# EAGLE design Engine Room Power Half (EAGLE 6.2)
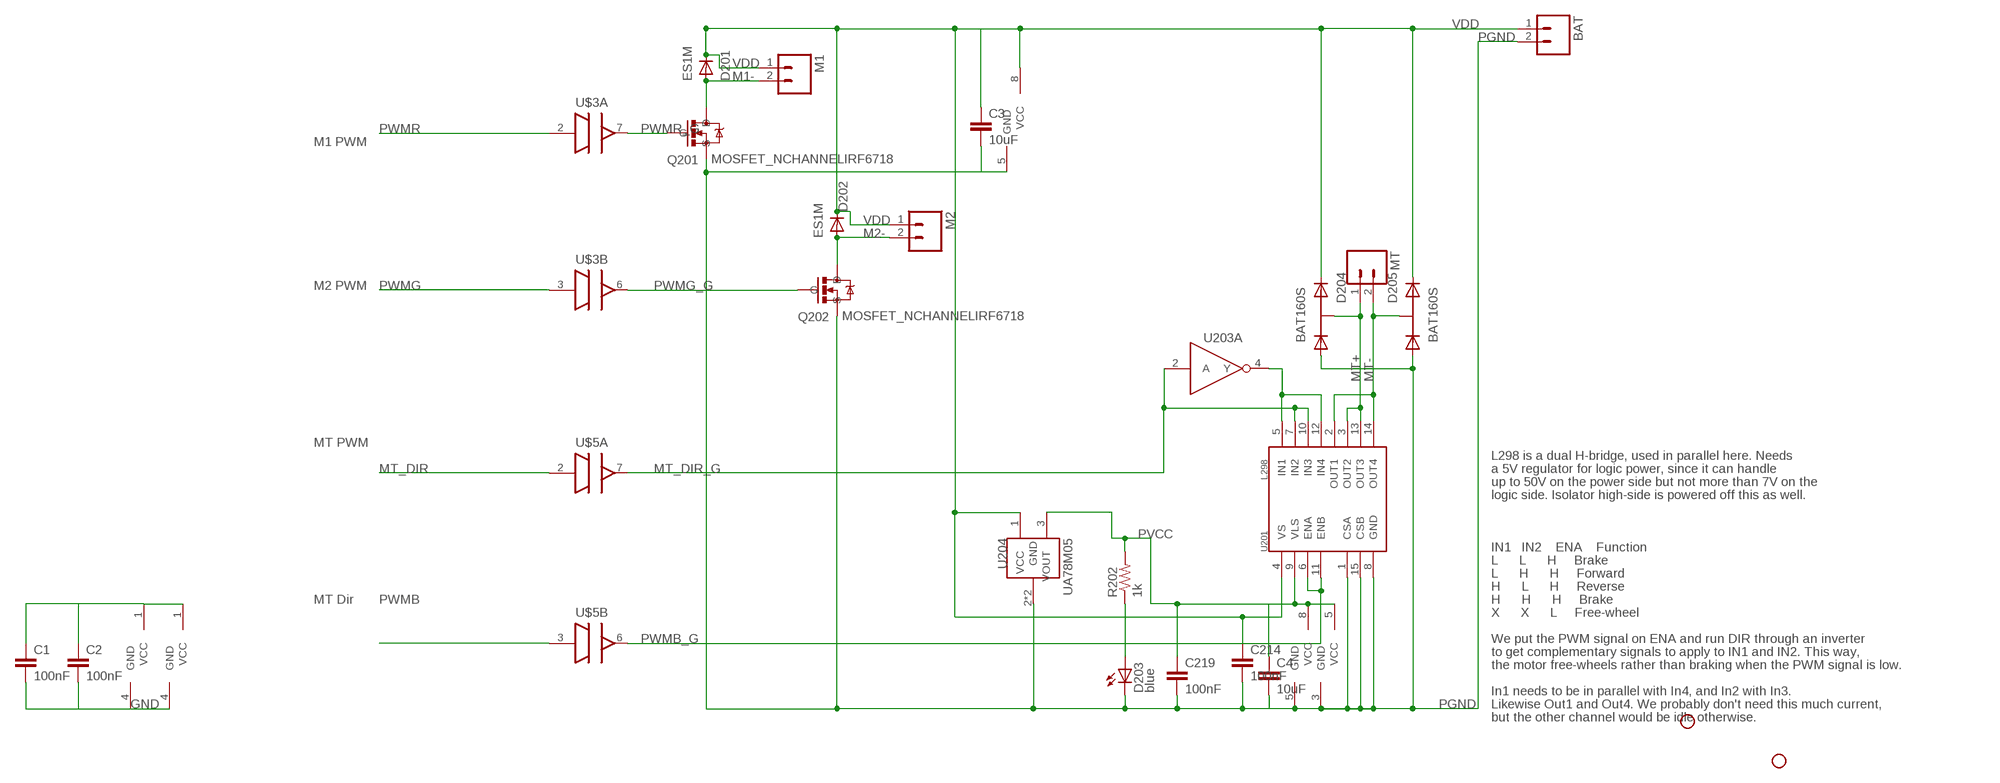
[diagram p0: schematic, sheet 1]

## Parts
BAT  M02PTH4  [1X02_XTRA_BIG]
C1  100nF  CAP0402-CAP  [0402-CAP]
C2  100nF  CAP0402-CAP  [0402-CAP]
C3  10uF  CAP1206  [1206]
C4  10uF  CAP1206  [1206]
C214  100nF  CAP1206  [1206]
C219  100nF  CAP0402-CAP  [0402-CAP]
D201  ES1M  DIODE-DO-214AC  [DO-214AC]
D202  ES1M  DIODE-DO-214AC  [DO-214AC]
D203  blue  LED0603  [LED-0603]
D204  BAT160S  [SOT-223]
D205  BAT160S  [SOT-223]
JP1  STAND-OFF  [STAND-OFF]
JP2  STAND-OFF  [STAND-OFF]
M1  M02PTH4  [1X02_XTRA_BIG]
M2  M02PTH4  [1X02_XTRA_BIG]
MT  M02PTH  [1X02]
Q201  MOSFET_NCHANNELIRF6718  [DIRECTFET_L6]
Q202  MOSFET_NCHANNELIRF6718  [DIRECTFET_L6]
R202  1k  RESISTOR0402-RES  [0402-RES]
U201  L298  [MULTIWATT15]
U203  MC74VHC1G04  [SOT-23-5]
U204  UA78M05  [SOT-223]
U$3  ADUM3221  [SO8N]
U$5  ADUM3221  [SO8N]

## Nets
GND: C1.2 C2.2 U$3.4(INP:GND) U$5.4(INP:GND)
M1- [power]: D201.A M1.2 Q201.D1(D) Q201.D2(D)
M2- [power]: D202.A M2.2 Q202.D1(D) Q202.D2(D)
MT+ [lt_power]: D204.4(K1A2) MT.1 U201.3(OUT2) U201.13(OUT3)
MT- [lt_power]: D205.4(K1A2) MT.2 U201.2(OUT1) U201.14(OUT4)
MT_DIR: U$5.2(A:IN)
MT_DIR_G: U201.7(IN2) U201.10(IN3) U203.2(A:A) U$5.7(A:OUT)
N$1: D203.A R202.1
N$2: U201.5(IN1) U201.12(IN4) U203.4(A:Y)
PGND [power]: BAT.2 C3.2 C4.2 C214.2 C219.2 D203.C D204.1(A1) D205.1(A1) Q201.S Q202.S U201.1(CSA) U201.8(GND) U201.15(CSB) U203.3(PWR:GND) U204.2(GND) U204.4(GND) U$3.5(OUTP:GND) U$5.5(OUTP:GND)
PVCC: C4.1 C219.1 R202.2 U201.9(VLS) U203.5(PWR:VCC) U204.3(VOUT) U$5.8(OUTP:VCC)
PWMB: U$5.3(B:IN)
PWMB_G: U201.6(ENA) U201.11(ENB) U$5.6(B:OUT)
PWMG: U$3.3(B:IN)
PWMG_G: Q202.G U$3.6(B:OUT)
PWMR: U$3.2(A:IN)
PWMR_G: Q201.G U$3.7(A:OUT)
VCC: C1.1 C2.1 U$3.1(INP:VCC) U$5.1(INP:VCC)
VDD [power]: BAT.1 C3.1 C214.1 D201.C D202.C D204.3(K2) D205.3(K2) M1.1 M2.1 U201.4(VS) U204.1(VCC) U$3.8(OUTP:VCC)

## Notes on the sheet
- M1 PWM
- M2 PWM
- MT PWM
- L298 is a dual H-bridge, used in parallel here. Needs
- a 5V regulator for logic power, since it can handle
- up to 50V on the power side but not more than 7V on the
- logic side. Isolator high-side is powered off this as well.
- IN1   IN2    ENA    Function
- L      L      H     Brake
- L      H      H     Forward
- H      L      H     Reverse
- MT Dir | H      H      H     Brake
- X      X      L     Free-wheel
- We put the PWM signal on ENA and run DIR through an inverter
- to get complementary signals to apply to IN1 and IN2. This way,
- the motor free-wheels rather than braking when the PWM signal is low.
- In1 needs to be in parallel with In4, and In2 with In3.
- Likewise Out1 and Out4. We probably don't need this much current,
- but the other channel would be idle otherwise.

## Library data of the parts
BAT M1 M2 MT = SparkFun:M02: Header 2 Standard 2-pin 0.1" header. Use with straight break away headers (SKU : PRT-00116), right angle break away headers (PRT-00553), swiss pins (PRT-00743), machine pins (PRT-00117), and female headers (PRT-00115). Molex polarized connector foot print use with SKU : PRT-08233 with associated crimp pins and housings.
C1 C2 C219 = SparkFun:CAP: Capacitor Standard 0603 ceramic capacitor, and 0.1" leaded capacitor.
C3 C4 C214 = SparkFun-Passives:CAP: Capacitor Standard 0603 ceramic capacitor, and 0.1" leaded capacitor.
D201 D202 = diode:DIODE-: DIODE
D203 = SparkFun:LED: LEDs Standard schematic elements and footprints for 5mm, 3mm, 1206, and 0603 sized LEDs. 5mm - Spark Fun Electronics SKU : COM-00529 (and others)
D204 D205 = KwanSystems:BAT160S
JP1 JP2 = SparkFun:STAND-OFF: Stand Off This is the mechanical footprint for a #4 phillips button head screw. Use the keepout ring to avoid running the screw head into surrounding components. SKU : PRT-00447
Q201 Q202 = KwanSystems:MOSFET_NCHANNEL
R202 = SparkFun:RESISTOR: Resistor Basic schematic elements and footprints for 0603, 1206, and PTH resistors.
U201 = SparkFun:L298: L298 Dual Full Bridge Driver
U203 = KwanSystems:MC74VHC1G04
U204 = KwanSystems:UA78M05
U$3 U$5 = KwanSystems:ADUM3221

## Net classes
0 default: width 0.152 mm, drill 0.33 mm, clearance 0.152 mm
1 power: width 0.152 mm, drill 0.33 mm, clearance 0.152 mm to class 0, clearance 0.152 mm
2 lt_power: width 0.152 mm, drill 0.33 mm, clearance 0.254 mm to class 0, clearance 0.254 mm to class 1, clearance 0.254 mm

## Board
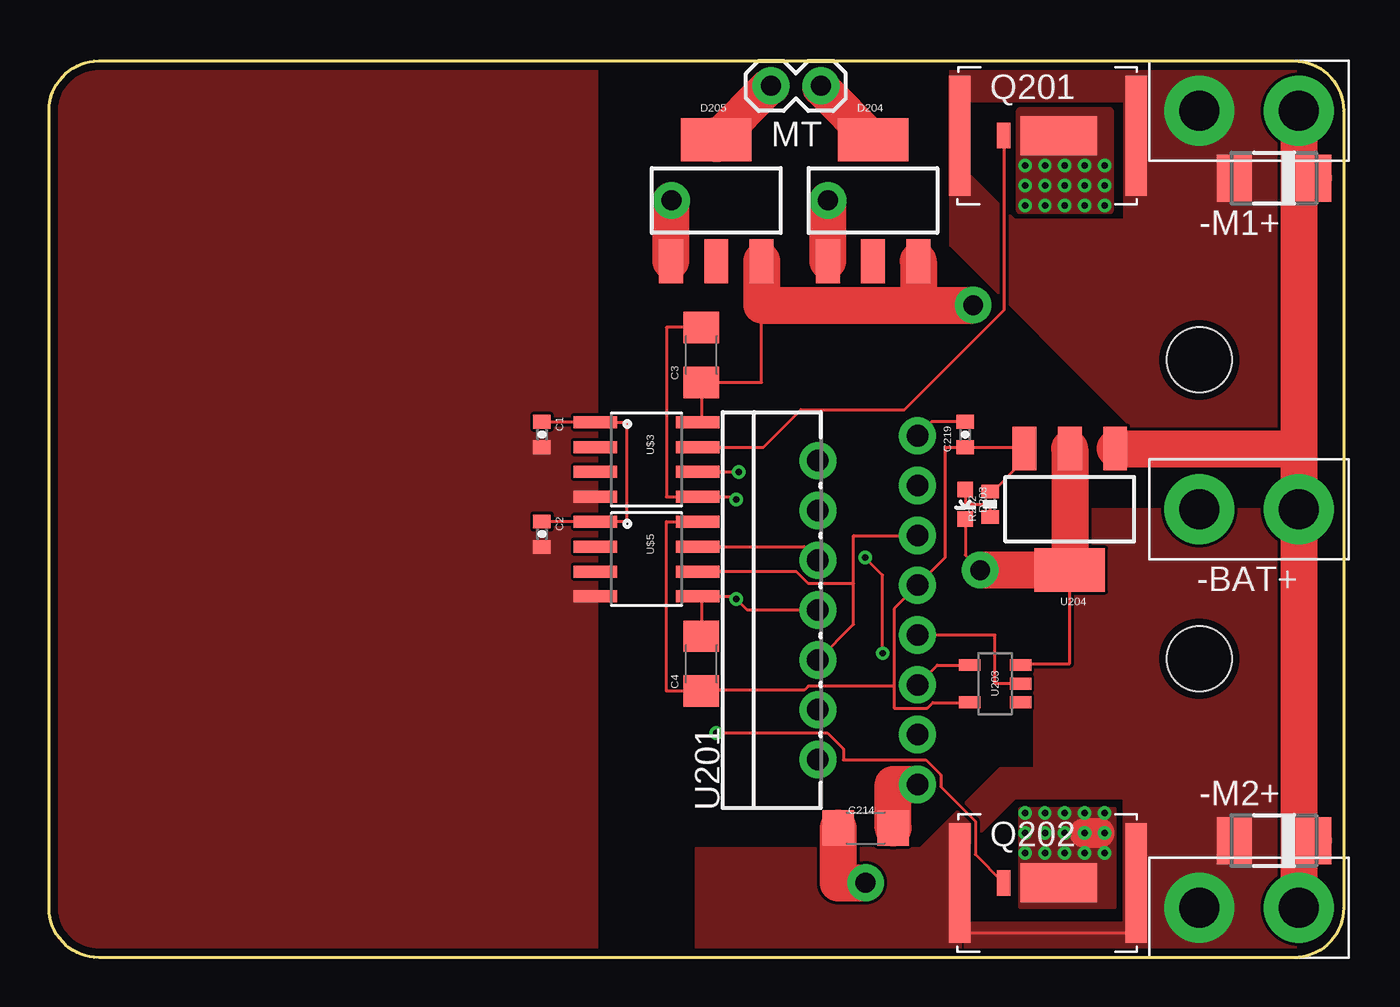
[diagram p1: board, top side]
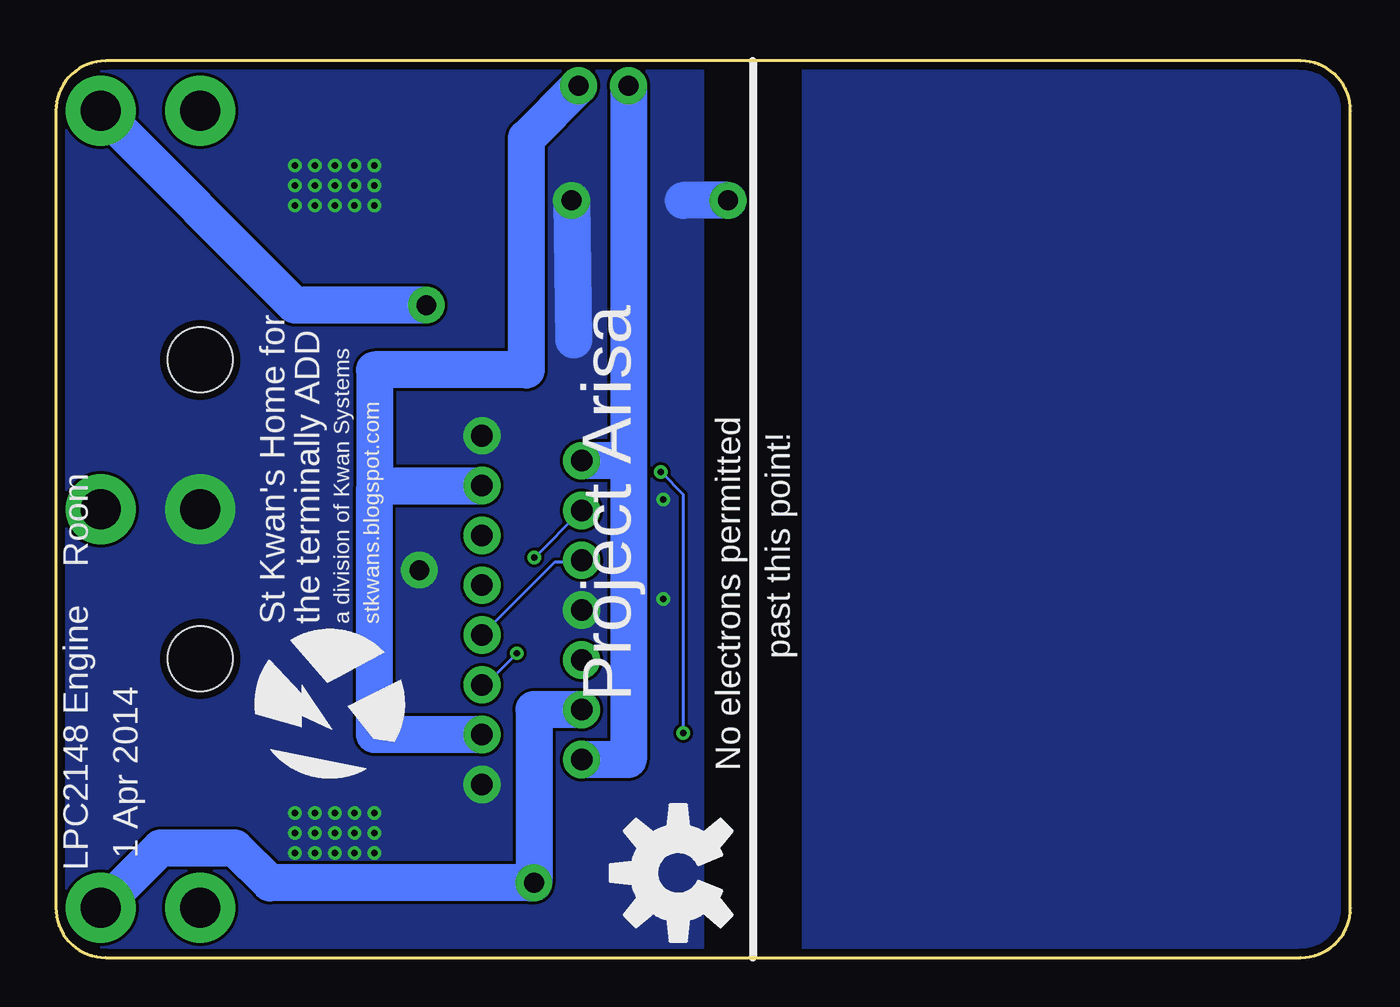
[diagram p2: board, bottom side, seen from below]

Size 66.04 x 45.72 mm. Coordinates in mm from the lower left corner, seen from the top.
Outline: 2.54,45.72 63.5,45.72 arc-90 66.04,43.18 66.04,2.54 arc-90 63.5,0 2.54,0 arc-90 0,2.54 0,43.18 arc-90 2.54,45.72
Copper layers (1*16): Top 0.0356mm / dielectric 1.5011mm / Bottom 0.0356mm
Design rules: minimum track width 6mil, minimum drill 13mil, track to track 6mil, track to pad 6mil, pad to pad 6mil, via to via 6mil, smd to smd 6mil, copper to edge 15mil, drill to drill 6mil, minimum pad ring 7mil, minimum via ring 7mil, stop-mask expansion 4mil, vias tented up to drill 21mil, thermal gap 10mil

### Footprints (pad centres in the part's own frame; a part is rotated, then mirrored left to right if it is on the bottom)
1X02_XTRA_BIG = drill 2.057 pad 3.556: 1 -2.54,0; 2 2.54,0
0402-CAP = smd 0.7 x 0.9: 1 -0.65,0; 2 0.65,0
1206 = smd 1.6 x 1.8: 1 -1.4,0; 2 1.4,0
DO-214AC = smd 1.8 x 2.4: A 2.025,0; C -2.025,0
LED-0603 = smd 0.8 x 0.8: A 0,-0.75; C 0,0.75
SOT-223 = smd 1.219 x 2.235: 1 -2.311,-3.099; 2 0,-3.099; 3 2.311,-3.099 | smd 3.6 x 2.2: 4 0,3.099
STAND-OFF = hole 3.302: 0,0
1X02 = drill 1.016 pad 1.88: 1 0,0; 2 2.54,0
DIRECTFET_L6 = smd 1.1 x 6.1: D1 -4.35,0; D2 4.65,0 | smd 0.7 x 1.3: G -2.1,0 | smd 3.9 x 2: S 0.7,0
0402-RES = smd 0.7 x 0.9: 1 -0.65,0; 2 0.65,0
MULTIWATT15 = drill 1.1 pad 1.9: 1 -8.95,-2.39; 2 -7.68,2.69; 3 -6.41,-2.39; 4 -5.14,2.69; 5 -3.87,-2.39; 6 -2.6,2.69; 7 -1.33,-2.39; 8 -0.06,2.69; 9 1.21,-2.39; 10 2.48,2.69; 11 3.75,-2.39; 12 5.02,2.69; 13 6.29,-2.39; 14 7.56,2.69; 15 8.83,-2.39
SOT-23-5 = smd 0.6 x 1.1: 1 -0.95,-1.3; 2 0,-1.3; 3 0.95,-1.3; 4 0.95,1.3; 5 -0.95,1.3
SO8N = smd 0.61 x 2.21: 1 -1.905,-2.616; 2 -0.635,-2.616; 3 0.635,-2.616; 4 1.905,-2.616; 5 1.905,2.616; 6 0.635,2.616; 7 -0.635,2.616; 8 -1.905,2.616

### Placement (x,y rotation side)
BAT  61.21,22.86 180 top
C1  25.15,26.67 270 top
C2  25.15,21.59 270 top
C3  33.27,30.73 90 top
C4  33.27,14.99 90 top
C214  41.66,6.6 0 top
C219  46.74,26.67 90 top
D201  62.48,39.75 180 top
D202  62.48,5.97 180 top
D203  46.74,23.11 180 top
D204  42.04,38.61 0 top
D205  34.04,38.61 0 top
JP1  58.67,15.24 0 top
JP2  58.67,30.48 90 top
M1  61.21,43.18 180 top
M2  61.21,2.54 180 top
MT  39.37,44.45 180 top
Q201  50.8,41.91 0 top
Q202  50.8,3.81 0 top
R202  48.01,23.11 90 top
U201  41.91,17.78 90 top
U203  48.26,13.97 90 top
U204  52.07,22.86 180 top
U$1  [KWAN_CIRCLE]  52.07,12.95 90 bottom
U$2  [OSHW-LOGO-L]  34.29,4.32 90 bottom
U$3  30.48,25.4 270 top
U$5  30.48,20.32 270 top

### Tracks (layer width: path | path; a pad name or v marks a point on that pad's centre or on a via)
GND
  pour Top (no thermals): 2.54,45.72 27.94,45.72 27.94,0 2.54,0 arc-90 0,2.54 0,43.18 arc-90
  pour Bottom (no thermals): 2.54,45.72 27.94,45.72 27.94,0 2.54,0 arc-90 0,2.54 0,43.18 arc-90
M1-
  pour Top (no thermals): 45.97,45.72 45.97,43.69 54.86,43.69 54.86,37.59 49.28,37.59 46.74,40.13 46.74,43.43 45.97,43.43 45.97,36.32 55.12,27.18 55.12,26.42 66.04,26.42 66.04,43.18 arc90 63.5,45.72
M2-
  Top 0.152: Q202.D1 46.74,3.52 46.74,1.27 55.45,1.27 Q202.D2
  pour Top (no thermals): 66.04,22.86 66.04,2.54 arc-90 63.5,0 46.74,0 46.74,1.78 54.86,1.78 54.86,8.13 49.28,8.13 46.48,5.33 46.48,0 33.02,0 33.02,5.59 44.45,5.59 48.51,9.65 50.29,9.65 50.29,22.86
MT+
  Top 1.88: MT.1 39.37,44.37 D204.4
  Bottom 1.88: U201.3 49.78,11.37 49.78,23.88 | 49.78,23.88 49.59,24.07 U201.13 | MT.1 42.04,41.78 42.04,29.97 49.78,29.97 49.78,23.88
MT-
  Top 1.88: MT.2 36.78,44.45 D205.4
  Top 2.286: 34.09,41.71 D205.4
  Bottom 1.88: MT.2 36.83,25.34 | 36.83,25.34 36.83,10.1 U201.2 | 36.83,25.34 U201.14
MT_DIR_G
  Top 0.152: U201.7 48.26,16.45 48.26,13.97 U203.2 | U201.10 38.52,20.95 U$5.7
  Bottom 0.152: U201.7 40.59,20.17 39.22,20.17 U201.10
N$1
  Top 0.152: D203.A 46.74,23.11 48.01,23.11 R202.1
N$2  (via drill 0.33)
  Top 0.152: 46.94,14.91 U203.4 45.31,14.92 U201.5 | v41.63,20.4 42.52,19.51 v42.52,15.52
  Bottom 0.152: v41.63,20.4 39.24,22.78 U201.12 | v42.52,15.52 44.12,13.92 U201.5
PGND  (via drill 0.33, 1.02 pad 1.88)
  Top 0.152: C219.2 | U203.3 49.3,14.91 | U203.3 | 46.79,27.3 C219.2 | 49.99,19.76 50.04,19.76 | U203.3 49.63,14.99 52.07,14.99 U204.4 | D203.C 46.74,20.52 v47.5,19.76 | U$5.5 33.27,18.41 | 33.27,18.41 C4.2 | C3.2 31.5,32.13 31.5,23.5 U$3.5 34.92,23.5 v35.05,23.37 | C219.2 45.01,27.32 U201.15 | 33.27,18.41 34.92,18.41 v35.05,18.29 35.62,17.72 U201.8
  Top 1.524: 53.59,6.35 v52.83,6.35
  Top 1.88: U204.2 U204.4 50.04,19.76 v47.5,19.76 | C214.2 43.06,8.83 U201.1 | D204.1 v39.73,38.61 | D205.1 31.73,38.58 v31.75,38.61
  Bottom 0.152: v35.05,23.37 35.05,23.11
  Bottom 1.88: v39.73,38.61 39.62,31.5 | v31.75,38.61 34.04,38.61
  other vias: 49.78,38.35 50.8,38.35 51.82,38.35 52.83,38.35 53.85,38.35 49.78,7.37 50.8,7.37 51.82,7.37 52.83,7.37 53.85,7.37 49.78,6.35 50.8,6.35 51.82,6.35 53.85,6.35 49.78,5.33 50.8,5.33 51.82,5.33 52.83,5.33 53.85,5.33 49.78,39.37 50.8,39.37 51.82,39.37 52.83,39.37 53.85,39.37 49.78,40.39 50.8,40.39 51.82,40.39 52.83,40.39 53.85,40.39
  pour Top (no thermals): 49.53,43.18 54.1,43.18 54.1,38.1 49.53,38.1
  pour Top (no thermals): 49.53,2.54 49.53,7.62 54.36,7.62 54.36,2.54
  pour Bottom (no thermals): 33.02,45.72 63.5,45.72 arc-90 66.04,43.18 66.04,2.54 arc-90 63.5,0 33.02,0
PVCC
  Top 0.152: 43.1,13.84 43.1,17.78 44.3,18.97 U201.9 45.72,20.41 45.72,26.02 C219.1 | 43.1,13.84 43.1,12.72 44.81,12.72 45.09,13.01 46.89,13.01 U203.5 | C219.1 49.76,26.01 U204.3 49.53,25.73 49.53,25.15 48.15,23.76 R202.2 | 46.69,25.96 C219.1 | U$5.8 31.5,22.23 31.5,13.59 C4.1 33.33,13.64 38.53,13.64 38.73,13.84 43.1,13.84
PWMB_G
  Top 0.152: 41.05,19.07 41.05,16.99 39.24,15.19 U201.6 | 41.05,19.07 41.05,21.51 44.3,21.51 U201.11 | U$5.6 38.12,19.68 38.73,19.07 41.05,19.07
PWMG
  Top 0.152: U$3.3 27,24.77
PWMG_G  (via drill 0.33)
  Top 0.152: Q202.G 48.64,3.86 47.24,5.26 47.24,6.96 45.49,8.71 45.49,9.32 44.73,10.08 40.51,10.08 40.51,10.64 39.7,11.46 v34.04,11.46 | U$3.6 v35.18,24.77
  Bottom 0.152: v35.18,24.77 34.04,23.62 v34.04,11.46
PWMR_G
  Top 0.152: Q201.G 48.72,41.91 48.72,33.02 43.64,27.94 38.35,27.94 36.45,26.04 U$3.7
VCC
  Top 0.152: C2.1 U$5.1 29.46,22.23 29.46,27.3 U$3.1 27.86,27.32 C1.1
VDD  (via drill 1.02 pad 1.88)
  Top 0.152: U$3.8 32.51,27.3 32.51,27.18 33.27,27.18 C3.1 36.35,29.33 36.35,33.27
  Top 1.524: 63.75,36.35 63.75,34.8 | 63.75,25.96 BAT.1
  Top 1.88: M1.1 63.75,39.75 | 63.75,39.75 63.75,34.8 BAT.1 63.75,5.97 | D201.C 63.75,39.75 | 63.75,5.97 M2.1 | D202.C 63.75,5.97 | U204.1 63.75,25.96 | C214.1 40.26,3.81 v41.66,3.81 | D205.3 36.35,33.27 44.35,33.27 | D204.3 44.35,33.27 | 44.35,33.27 v47.14,33.27
  Bottom 1.88: v41.66,3.81 55.12,3.81 56.9,5.59 60.71,5.59 M2.1 | U201.4 41.66,12.64 v41.66,3.81 | v41.66,3.81 41.78,3.81 | v47.14,33.27 53.85,33.27 M1.1

### Text on the board
tPlace: -M1+ | -BAT+ | -M2+
bPlace: stkwans.blogspot.com | a division of Kwan Systems | the terminally ADD | St Kwan's Home for | past this point! | Project Arisa | No electrons permitted | 1 Apr 2014 | LPC2148 Engine Room